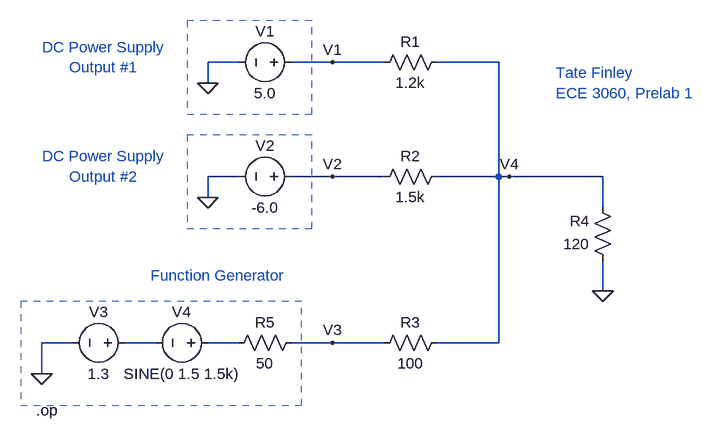
[diagram p0: schematic ECE3060_Experiment1_Prelab.asc]
ECE3060_Experiment1_Prelab.asc, the LTspice schematic file:
Version 4
SHEET 1 920 680
WIRE 208 64 160 64
WIRE 352 64 288 64
WIRE 432 64 352 64
WIRE 608 64 512 64
WIRE 160 96 160 64
WIRE 208 240 160 240
WIRE 352 240 288 240
WIRE 432 240 352 240
WIRE 608 240 608 64
WIRE 608 240 512 240
WIRE 624 240 608 240
WIRE 768 240 624 240
WIRE 160 272 160 240
WIRE 768 288 768 240
WIRE 768 416 768 368
WIRE -48 496 -96 496
WIRE 80 496 32 496
WIRE 208 496 160 496
WIRE 352 496 288 496
WIRE 432 496 352 496
WIRE 608 496 608 240
WIRE 608 496 512 496
WIRE -96 544 -96 496
FLAG 160 96 0
FLAG 160 272 0
FLAG 768 416 0
FLAG -96 544 0
FLAG 352 64 V1
FLAG 352 240 V2
FLAG 352 496 V3
FLAG 624 240 V4
SYMBOL voltage 304 240 R90
WINDOW 0 -32 56 VBottom 2
WINDOW 3 32 56 VTop 2
WINDOW 123 0 0 Left 0
WINDOW 39 0 0 Left 0
SYMATTR InstName V2
SYMATTR Value -6.0
SYMBOL voltage 304 64 R90
WINDOW 0 -32 56 VBottom 2
WINDOW 3 32 56 VTop 2
WINDOW 123 0 0 Left 0
WINDOW 39 0 0 Left 0
SYMATTR InstName V1
SYMATTR Value 5.0
SYMBOL res 528 48 R90
WINDOW 0 0 56 VBottom 2
WINDOW 3 32 56 VTop 2
SYMATTR InstName R1
SYMATTR Value 1.2k
SYMBOL res 528 224 R90
WINDOW 0 0 56 VBottom 2
WINDOW 3 32 56 VTop 2
SYMATTR InstName R2
SYMATTR Value 1.5k
SYMBOL res 528 480 R90
WINDOW 0 0 56 VBottom 2
WINDOW 3 32 56 VTop 2
SYMATTR InstName R3
SYMATTR Value 100
SYMBOL res 784 384 R180
WINDOW 0 36 76 Left 2
WINDOW 3 36 40 Left 2
SYMATTR InstName R4
SYMATTR Value 120
SYMBOL res 304 480 R90
WINDOW 0 0 56 VBottom 2
WINDOW 3 32 56 VTop 2
SYMATTR InstName R5
SYMATTR Value 50
SYMBOL voltage 48 496 R90
WINDOW 0 -32 56 VBottom 2
WINDOW 3 32 56 VTop 2
WINDOW 123 0 0 Left 0
WINDOW 39 0 0 Left 0
SYMATTR InstName V3
SYMATTR Value 1.3
SYMBOL voltage 176 496 R90
WINDOW 0 -32 56 VBottom 2
WINDOW 3 32 56 VTop 2
WINDOW 123 0 0 Left 0
WINDOW 39 0 0 Left 0
SYMATTR InstName V4
SYMATTR Value SINE(0 1.5 1.5k)
TEXT 72 392 Left 2 ;Function Generator
TEXT 0 56 Center 2 ;DC Power Supply\nOutput #1
TEXT 0 224 Center 2 ;DC Power Supply\nOutput #2
TEXT -104 600 Left 2 !.op
TEXT 696 80 Left 2 ;Tate Finley\nECE 3060, Prelab 1
RECTANGLE Normal 128 320 320 176 2
RECTANGLE Normal 128 144 320 0 2
RECTANGLE Normal -128 592 304 432 2

The netlist it stands for:
* ECE3060_Experiment1_Prelab.asc
V2 V2 0 -6.0
V1 V1 0 5.0
R1 V4 V1 1.2k
R2 V4 V2 1.5k
R3 V4 V3 100
R4 0 V4 120
R5 V3 N002 50
V3 N001 0 1.3
V4 N002 N001 SINE(0 1.5 1.5k)
* Function Generator
* DC Power Supply
* Output #1
* DC Power Supply
* Output #2
.op
* Tate Finley
* ECE 3060, Prelab 1
.backanno
.end